# EAGLE design SolenoidControl (EAGLE 7.1.0)
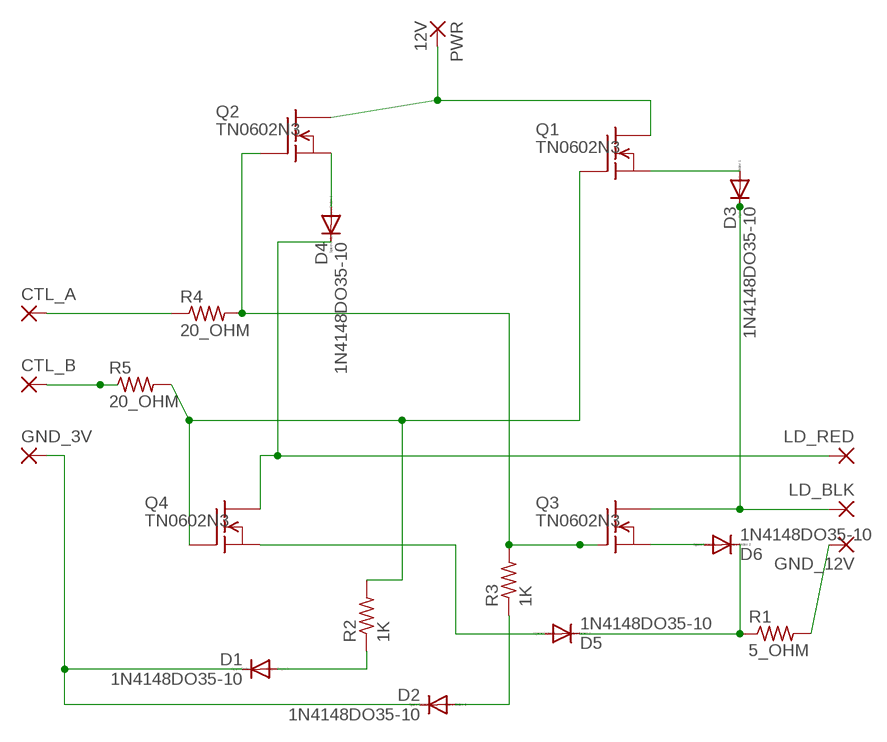
[diagram p0: schematic, sheet 1]

## Parts
CTL_A  2,15/1,0  [2,15/1,0]
CTL_B  2,15/1,0  [2,15/1,0]
D1  1N4148DO35-10  [DO35-10]
D2  1N4148DO35-10  [DO35-10]
D3  1N4148DO35-10  [DO35-10]
D4  1N4148DO35-10  [DO35-10]
D5  1N4148DO35-10  [DO35-10]
D6  1N4148DO35-10  [DO35-10]
GND_3V  2,15/1,0  [2,15/1,0]
GND_12V  2,15/1,0  [2,15/1,0]
LD_BLK  2,15/1,0  [2,15/1,0]
LD_RED  2,15/1,0  [2,15/1,0]
PWR  12V  2,15/1,0  [2,15/1,0]
Q1  TN0602N3  [TO-92]
Q2  TN0602N3  [TO-92]
Q3  TN0602N3  [TO-92]
Q4  TN0602N3  [TO-92]
R1  5_OHM  R-US_0207/12  [0207/12]
R2  1K  R-US_0207/12  [0207/12]
R3  1K  R-US_0207/12  [0207/12]
R4  20_OHM  R-US_0207/12  [0207/12]
R5  20_OHM  R-US_0207/12  [0207/12]

## Nets
N$1: PWR.1(P) Q1.3(D) Q2.3(D)
N$2: D3.A Q1.1(S)
N$3: D4.A Q2.1(S)
N$4: D4.C LD_RED.1(P) Q4.3(D)
N$5: D3.C LD_BLK.1(P) Q3.3(D)
N$6: GND_12V.1(P) R1.2
N$7: D5.A Q4.1(S)
N$8: D2.A R3.1
N$9: Q2.2(G) Q3.2(G) R3.2 R4.2
N$10: Q1.2(G) Q4.2(G) R2.2 R5.2
N$11: CTL_B.1(P) R5.1
N$12: CTL_A.1(P) R4.1
N$13: D1.A R2.1
N$14: D1.C D2.C GND_3V.1(P)
N$15: D5.C D6.C R1.1
N$16: D6.A Q3.1(S)

## Library data of the parts
CTL_A CTL_B GND_3V GND_12V LD_BLK LD_RED PWR = wirepad:2,15/1,0: THROUGH-HOLE PAD
D1-D6 = diode:1N4148: DIODE high speed (Philips)
Q1-Q4 = transistor-fet:TN0602N3: N-Channel Enhancement MOSFET 20V; 4A; 0,75Ohm
R1-R5 = resistor:R-US_: RESISTOR, American symbol

## Board
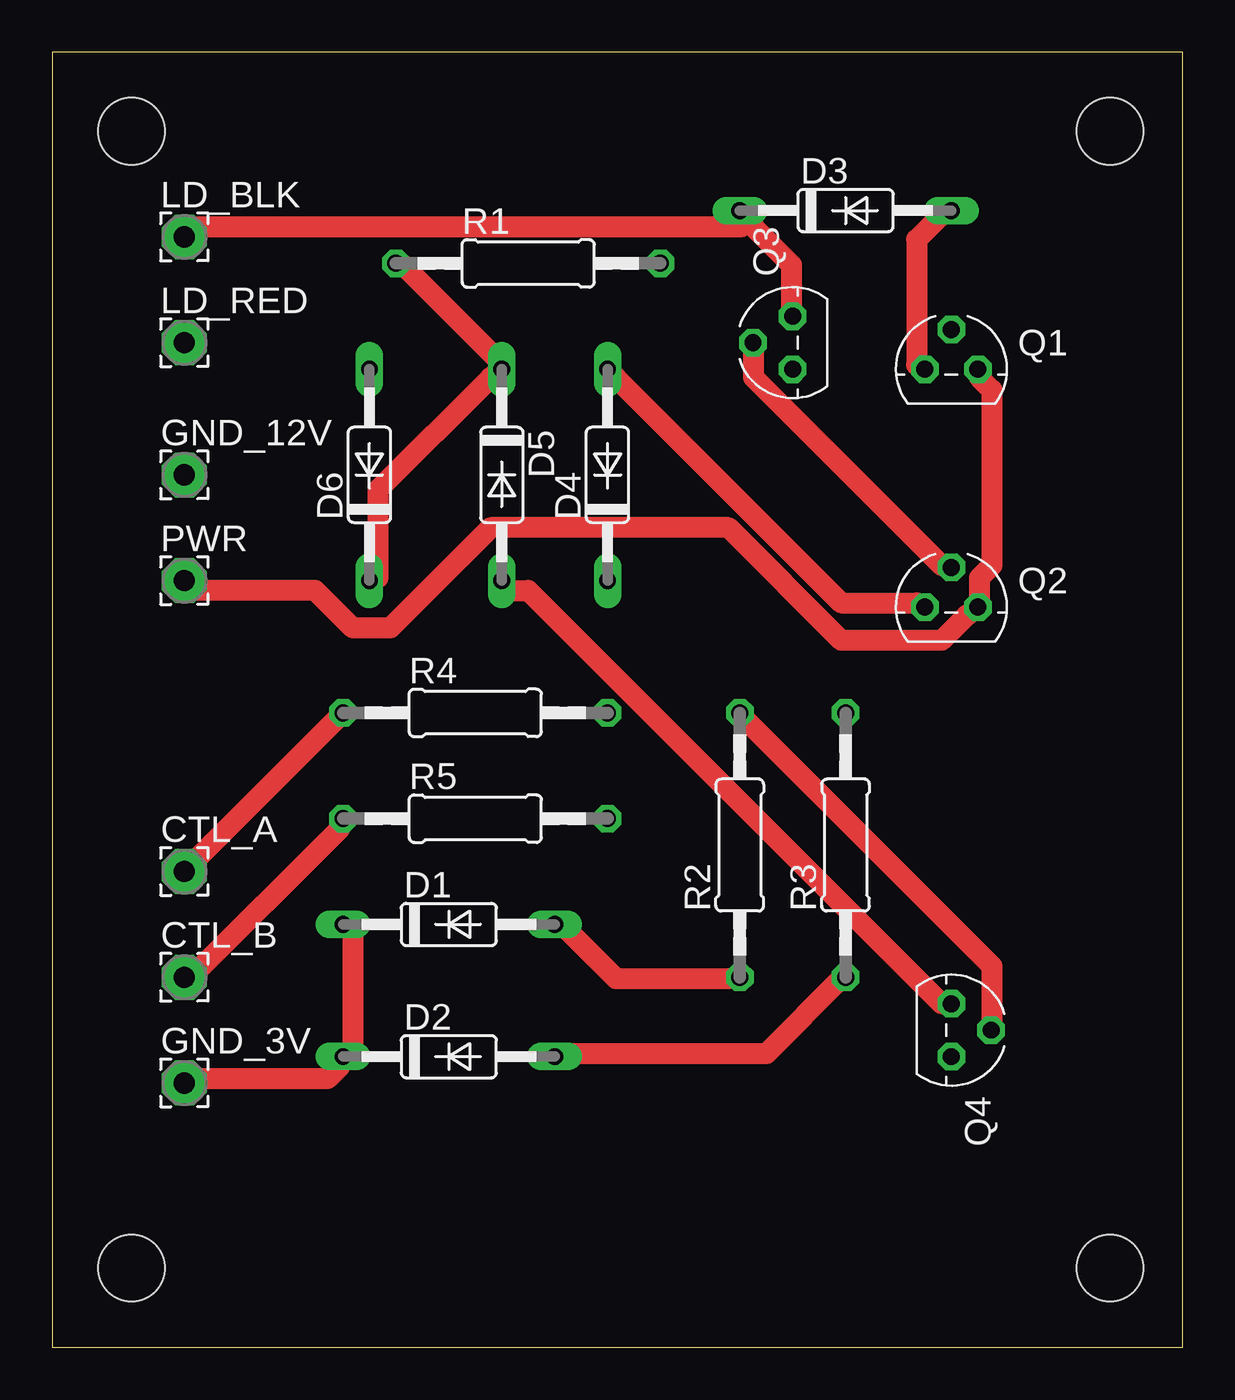
[diagram p1: board, top side]
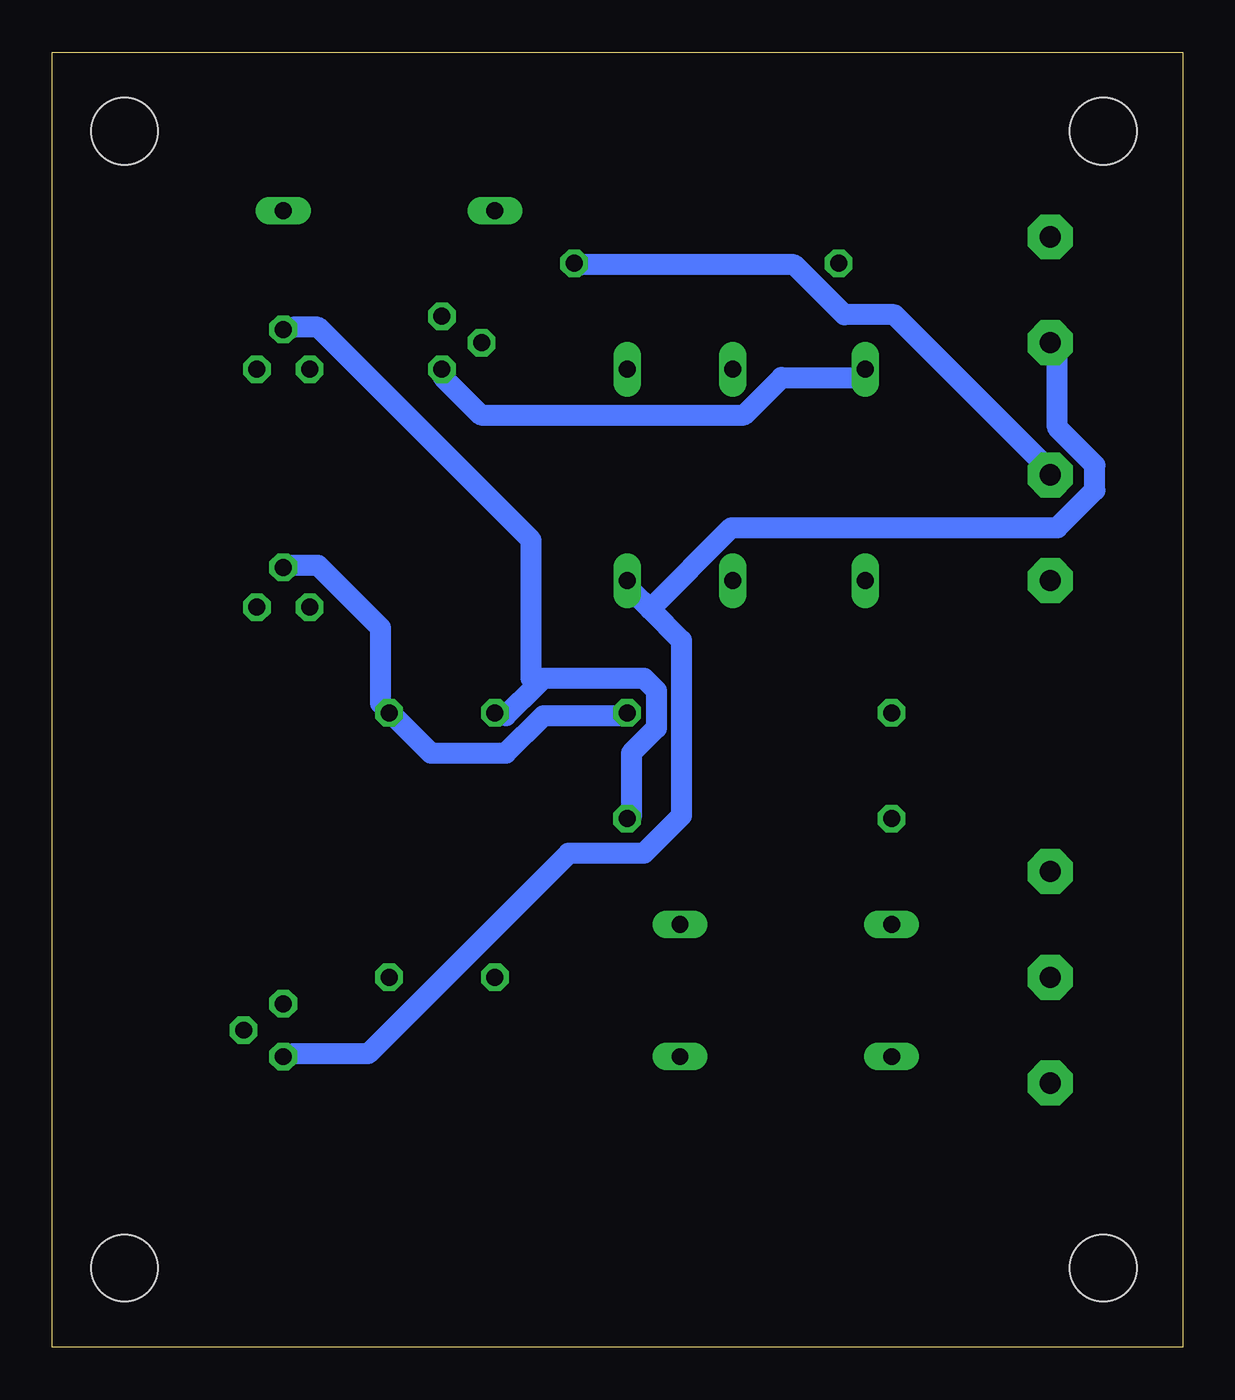
[diagram p2: board, bottom side, seen from below]

Size 54.28 x 62.22 mm. Coordinates in mm from the lower left corner, seen from the top.
Outline: 0,0 54.28,0 54.28,62.22 0,62.22 0,0
Copper layers (1*16): Top 0.035mm / dielectric 1.5mm / Bottom 0.035mm
Design rules "default *": minimum track width 1mm, minimum drill 1mm, track to track 8mil, track to pad 8mil, pad to pad 8mil, via to via 8mil, smd to smd 8mil, copper to edge 40mil, drill to drill 1mm, minimum pad ring 10mil, minimum via ring 8mil, stop-mask expansion 4mil, vias tented up to drill 0mil, thermal gap 10mil
Holes 3.2 mm at 3.81,3.81 50.8,3.81 50.8,58.42 3.81,58.42

### Footprints (pad centres in the part's own frame; a part is rotated, then mirrored left to right if it is on the bottom)
2,15/1,0 = drill 1.016 pad 2.159 octagon: 1 0,0
DO35-10 = drill 0.813 long: A 5.08,0; C -5.08,0
TO-92 = drill 0.813 octagon: 1 -1.27,0; 2 0,1.905; 3 1.27,0
0207/12 = drill 0.813 octagon: 1 -6.35,0; 2 6.35,0

### Placement (x,y rotation side)
CTL_A  6.35,22.86 0 top
CTL_B  6.35,17.78 0 top
D1  19.05,20.32 0 top
D2  19.05,13.97 0 top
D3  38.1,54.61 0 top
D4  26.67,41.91 90 top
D5  21.59,41.91 270 top
D6  15.24,41.91 90 top
GND_3V  6.35,12.7 0 top
GND_12V  6.35,41.91 0 top
LD_BLK  6.35,53.34 0 top
LD_RED  6.35,48.26 0 top
PWR  6.35,36.83 0 top
Q1  43.18,46.99 0 top
Q2  43.18,35.56 0 top
Q3  35.56,48.26 90 top
Q4  43.18,15.24 270 top
R1  22.86,52.07 0 top
R2  33.02,24.13 90 top
R3  38.1,24.13 90 top
R4  20.32,30.48 0 top
R5  20.32,25.4 0 top

### Tracks (layer width: path | path; a pad name or v marks a point on that pad's centre or on a via)
N$1
  Top 1: Q1.3 44.52,46.59 45.12,45.99 45.12,37.57 44.52,36.97 44.52,35.76 Q2.3 43.92,35.16 42.71,33.96 37.9,33.96 32.49,39.37 21.06,39.37 16.24,34.56 14.44,34.56 12.63,36.36 6.62,36.36 PWR.1
N$2
  Top 1: Q1.1 41.51,47.19 41.51,53.21 42.71,54.41 D3.A
N$3
  Top 1: Q2.1 41.51,35.76 37.9,35.76 27.07,46.59 D4.A
N$4
  Bottom 1: 25.57,35.46 26.47,36.36 D4.C | 25.57,35.46 24.06,33.96 24.06,25.53 25.87,23.73 29.48,23.73 39.1,14.11 42.71,14.11 Q4.3 | 25.57,35.46 21.66,39.37 6.02,39.37 4.21,41.18 4.21,42.38 6.02,44.19 6.02,47.79 LD_RED.1
N$5
  Top 1: 33.39,54.11 33.09,54.41 D3.C | 33.39,54.11 35.49,52.01 35.49,49.6 Q3.3 | LD_BLK.1 6.62,53.81 33.09,53.81 33.39,54.11
N$6
  Bottom 1: R1.2 28.88,52.01 18.65,52.01 16.24,49.6 13.84,49.6 6.62,42.38 GND_12V.1
N$7
  Top 1: Q4.1 42.71,16.51 22.86,36.36 21.66,36.36 D5.A
N$8
  Top 1: D2.A 24.67,14.11 34.29,14.11 37.9,17.71 R3.1
N$9
  Top 1: Q3.2 33.69,47.79 33.69,46.59 42.71,37.57 Q2.2
  Bottom 1: R4.2 27.07,30.35 30.68,30.35 32.49,28.54 36.1,28.54 37.9,30.35 R3.2 38.5,30.95 38.5,34.56 41.51,37.57 42.71,37.57 Q2.2
N$10
  Top 1: Q4.2 45.12,15.31 45.12,18.32 33.09,30.35 R2.2
  Bottom 1: 30.98,31.85 32.49,30.35 R2.2 | 30.98,31.85 30.68,32.15 25.87,32.15 25.27,31.55 25.27,29.75 26.47,28.54 26.47,25.53 R5.2 | Q1.2 42.71,49 41.51,49 31.28,38.77 31.28,32.15 30.98,31.85
N$11
  Top 1: R5.1 13.84,24.93 6.62,17.71 CTL_B.1
N$12
  Top 1: R4.1 13.84,30.35 6.62,23.13 CTL_A.1
N$13
  Top 1: R2.1 32.49,17.71 27.07,17.71 24.67,20.12 D1.A
N$14
  Top 1: D1.C 14.44,20.12 14.44,14.11 D2.C 13.84,13.5 13.23,12.9 6.62,12.9 GND_3V.1
N$15
  Top 1: D6.C 15.64,36.97 15.64,41.18 21.06,46.59 D5.C 21.66,47.19 16.84,52.01 R1.1
N$16
  Bottom 1: D6.A 15.64,46.59 19.25,46.59 21.06,44.79 33.69,44.79 35.49,46.59 Q3.1